# Altium schematic sheet Output terminals.SchDoc
size A4
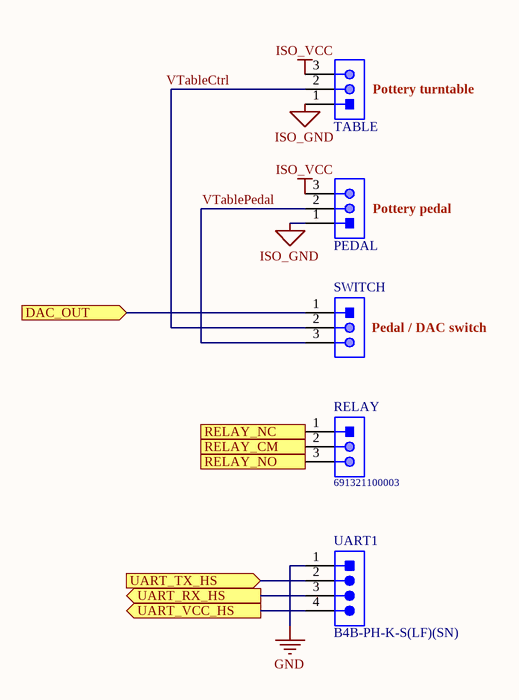
[diagram p0: Output terminals.SchDoc]

## Parts
PEDAL  691321300003  [691321300003]  (value not drawn)
RELAY  691321100003  [691321100003]
SWITCH  691321300003  [691321300003]  (value not drawn)
TABLE  691321300003  [691321300003]  (value not drawn)
UART1  B4B-PH-K-S(LF)(SN)  [JST-B4B-PH-K-S_V]

## Ports
DAC_OUT (in), RELAY_CM (in), RELAY_NC (in), RELAY_NO (in), UART_RX_HS (out), UART_TX_HS (in), UART_VCC_HS (out)

## Nets
GND: UART1.1
ISO_GND: PEDAL.1 TABLE.1
ISO_VCC: PEDAL.3 TABLE.3
DAC_OUT: SWITCH.1 ; port DAC_OUT
RELAY_CM: RELAY.2 ; port RELAY_CM
RELAY_NC: RELAY.1 ; port RELAY_NC
RELAY_NO: RELAY.3 ; port RELAY_NO
UART_RX_HS: UART1.3 ; port UART_RX_HS
UART_TX_HS: UART1.2 ; port UART_TX_HS
UART_VCC_HS: UART1.4 ; port UART_VCC_HS
VTableCtrl: SWITCH.2 TABLE.2
VTablePedal: PEDAL.2 SWITCH.3

## Notes on the sheet
- (near TABLE) Pottery turntable
- (near PEDAL) Pottery pedal
- (near SWITCH) Pedal / DAC switch

## Library data of the parts
PEDAL SWITCH TABLE = CMP-1502-01864-1: Serie 321 - 3.81mm Vertical PCB Header WR-TBL, 3 pin; Manufacturer: Wurth Elektronik; Pin Number: 3; Gender: Male; Datasheet URL: http://katalog.we-online.de/em/datasheet/6913213000xx.pdf; Package Reference: 691321300003; Pitch: 3.81mm; Publisher: WurthElektronik; Part Number: 691321300003; Mounting Technology: THT; Packaging: Box; Manufacturer URL: http://www.we-online.de; Operating Temperature: -40to105degC
RELAY = CMP-1502-01784-1: Serie 3211 - 3.50mm Vertical PCB Header WR-TBL, 3 pin; Manufacturer: Wurth Elektronik; Pin Number: 3; Gender: Male; Datasheet URL: http://katalog.we-online.de/em/datasheet/6913211000xx.pdf; Package Reference: 691321100003; Pitch: 3.50mm; Publisher: WurthElektronik; Part Number: 691321100003; Mounting Technology: THT; Packaging: Box; Manufacturer URL: http://www.we-online.de; Operating Temperature: -40to105degC
UART1 = CMP-2000-05165-1: Male Header, Pitch 2 mm, 1 x 4 Position, Height 6 mm, Tail Length 3.4 mm, -25 to 85 degC, RoHS, Bulk; Manufacturer: JST; No of Positions: 4; Style/Orientation: StraightHeader/Plug; Pitch: 2mm; Datasheet URL: http://datasheet.octopart.com/B4B-PH-K-S%28LF%29%28SN%29-JST-datasheet-10558886.pdf; Type: ShroudedHeader; Manufacturer URL: http://www.jst.com/home2.html; Termination: Crimp; Datasheet Version: Apr-09